# Altium schematic sheet UWB_R_v1.4.SchDoc
size A2; SheetNumber: 1; SheetTotal: 1; SPICEModelCachePXCNLXFV: <root> / <DocumentId>PXCNLXFV</DocumentId> / </root>
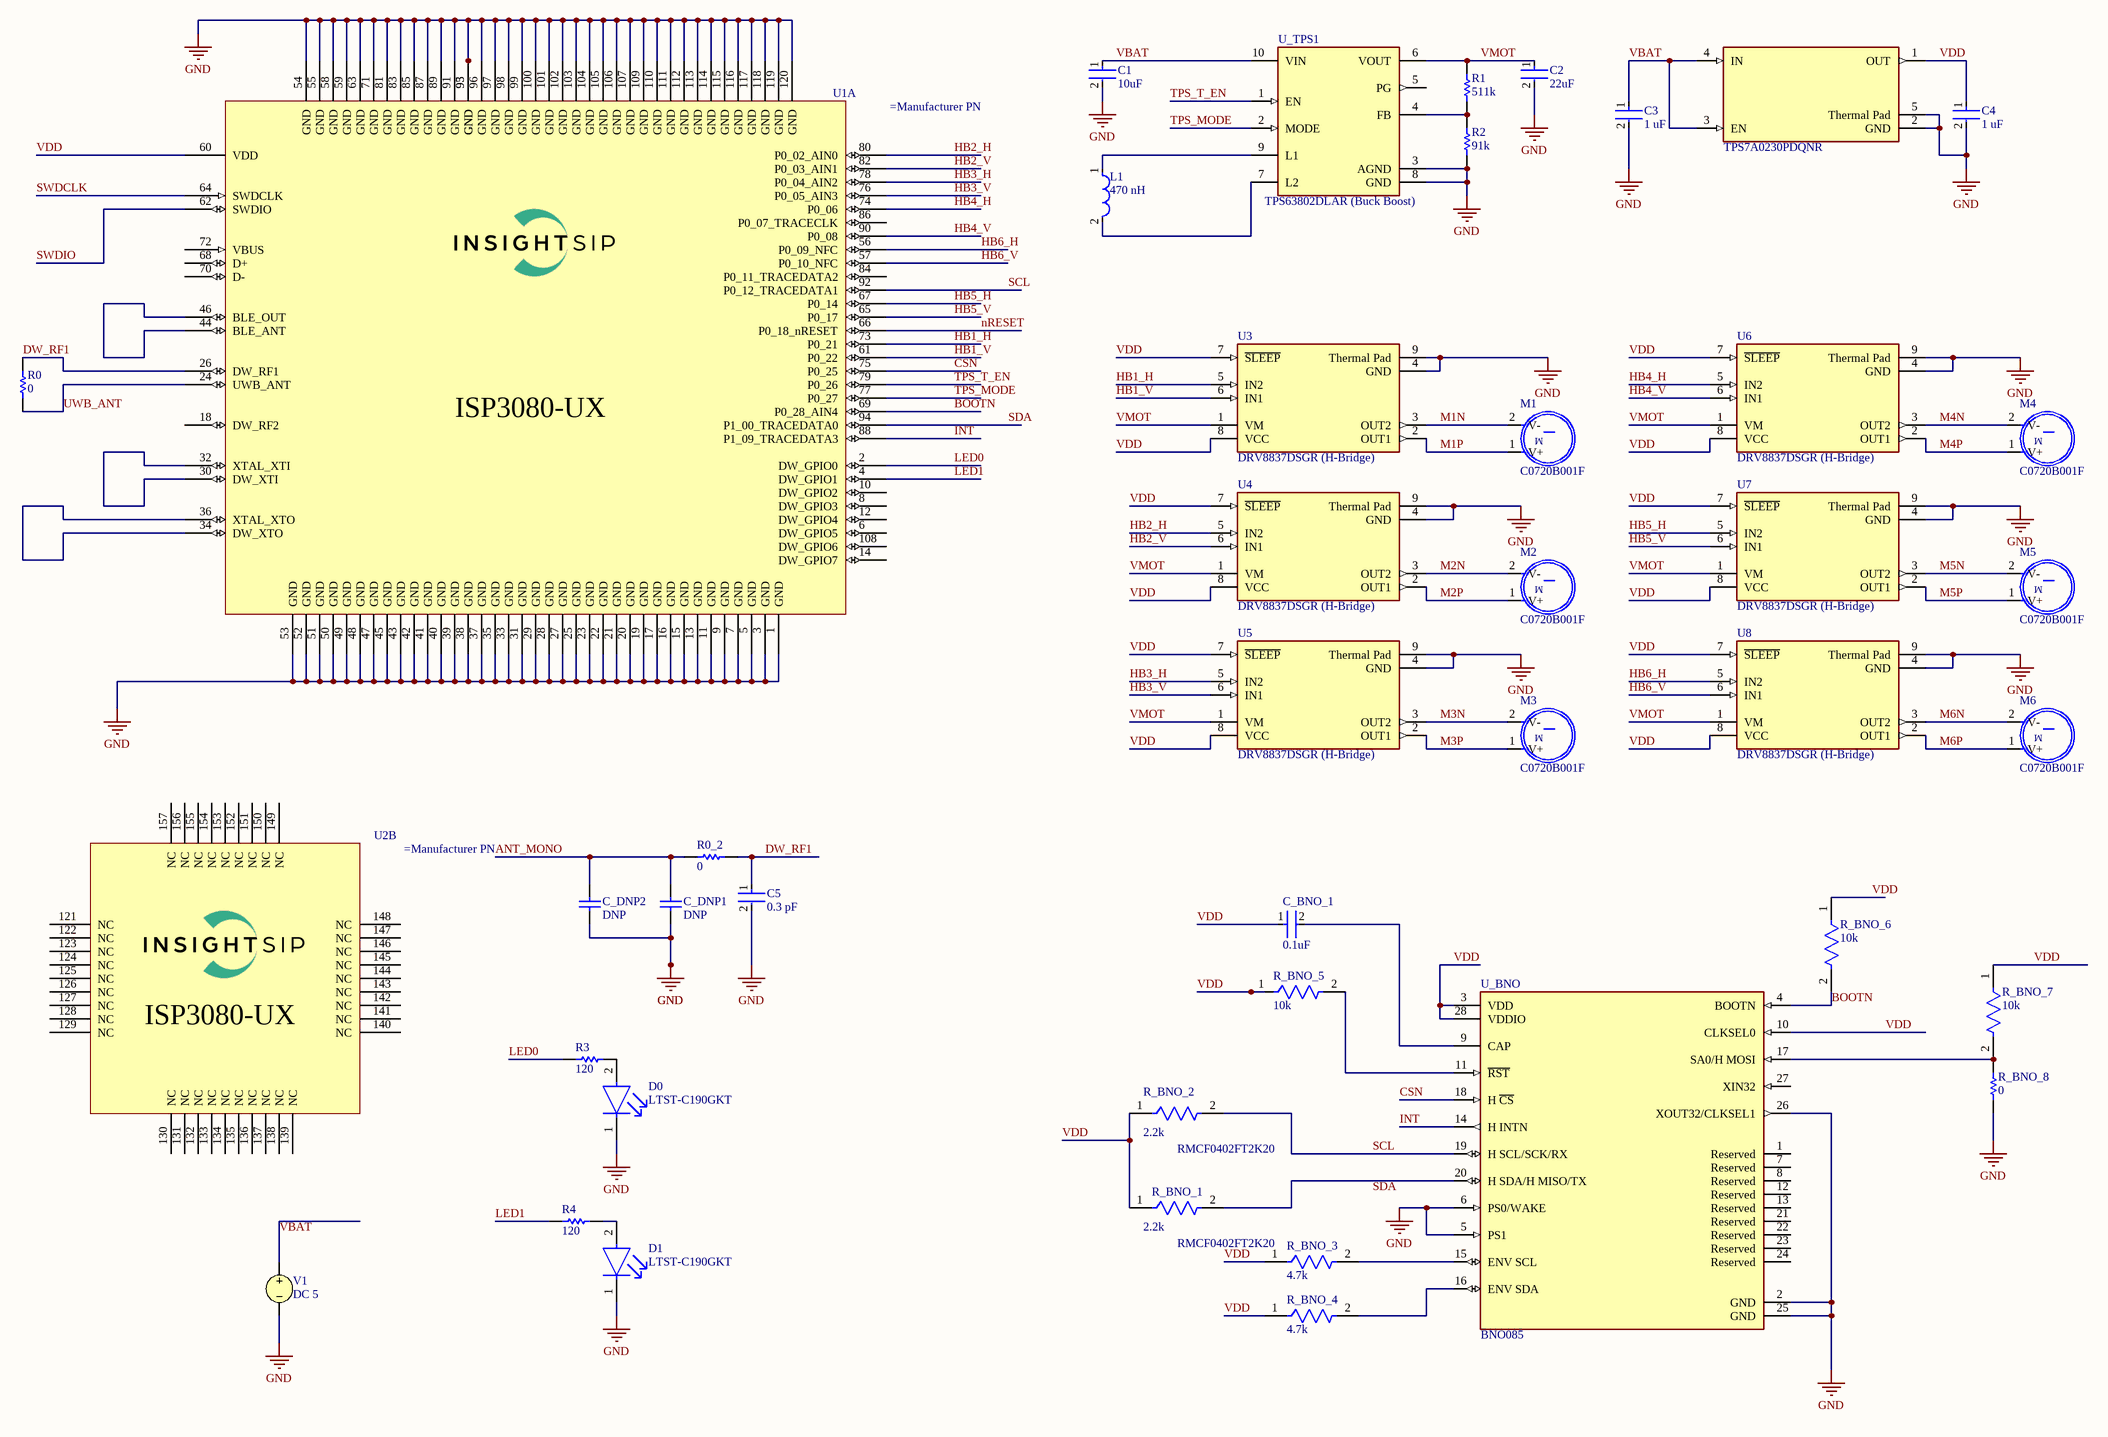
[diagram p0: UWB_R_v1.4.SchDoc]

## Parts
C1  10uF  [FP-CL05A106MP5NUNC-MFG]
C2  22uF  [FP-GRM188-0_2-IPC_C]
C3  1 uF  [FP-CL10-IPC_C]
C4  1 uF  [FP-CL10-IPC_C]
C5  0.3 pF  [FP-GRM033-0_03-IPC_B]
C_BNO_1  0.1uF  [FP-0402B104K160CT-IPC_C]
C_DNP1  DNP  [CAPC1005X56X25NL10T15]
C_DNP2  DNP  [CAPC1005X56X25NL10T15]
D0  LTST-C190GKT  [FP-LTST-C190GKT-MFG]
D1  LTST-C190GKT  [FP-LTST-C190GKT-MFG]
L1  470 nH  [FP-CIGT201610-MFG]
M1  C0720B001F  [XDCR_C0720B001F]
M2  C0720B001F  [XDCR_C0720B001F]
M3  C0720B001F  [XDCR_C0720B001F]
M4  C0720B001F  [XDCR_C0720B001F]
M5  C0720B001F  [XDCR_C0720B001F]
M6  C0720B001F  [XDCR_C0720B001F]
R0  0  [RESC1005X40X25NL05T10]
R0_2  0  [RESC1005X40X25NL05T10]
R1  511k  [RESC1608X55X25ML10T15]
R2  91k  [RESC0603X26X15NL03T05]
R3  120  [RESC2013X50X40ML20T20]
R4  120  [RESC2013X50X40ML20T20]
R_BNO_1  2.2k  [Stackpole_RMCF0402_IPC_A]
R_BNO_2  2.2k  [Stackpole_RMCF0402_IPC_A]
R_BNO_3  4.7k  [FP-RC0402-0_4-MFG]
R_BNO_4  4.7k  [FP-RC0402-0_4-MFG]
R_BNO_5  10k  [FP-RC0603-0_55-IPC_C]
R_BNO_6  10k  [FP-RC0603-0_55-IPC_C]
R_BNO_7  10k  [FP-RC0603-0_55-IPC_C]
R_BNO_8  0  [RESC1005X40X25NL05T10]
TPS7A0230PDQNR  TPS7A0230PDQNR  [Texas_Instruments_DQN0004A_MFG]  (value not drawn)
U1  (no value)  [ISP3080-UX]  (part A of 2)
U2  (no value)  (part B of 2)
U3  DRV8837DSGR (H-Bridge)  [FP-DSG0008A-MFG]
U4  DRV8837DSGR (H-Bridge)  [FP-DSG0008A-MFG]
U5  DRV8837DSGR (H-Bridge)  [FP-DSG0008A-MFG]
U6  DRV8837DSGR (H-Bridge)  [FP-DSG0008A-MFG]
U7  DRV8837DSGR (H-Bridge)  [FP-DSG0008A-MFG]
U8  DRV8837DSGR (H-Bridge)  [FP-DSG0008A-MFG]
U_BNO  BNO085  [FP-BNO085-MFG]
U_TPS1  TPS63802DLAR (Buck Boost)  [FP-DLA0010A-MFG]
V1  DC 5

## Nets
GND: C1.2 C2.2 C3.2 C4.2 C5.2 C_DNP1.1 C_DNP2.1 D0.1(C) D1.1(C) R2.1 R_BNO_8.2 TPS7A0230PDQNR.2(GND) TPS7A0230PDQNR.5(Thermal_Pad) U1.1(GND) U1.3(GND) U1.5(GND) U1.7(GND) U1.9(GND) U1.11(GND) U1.13(GND) U1.15(GND) U1.16(GND) U1.17(GND) U1.19(GND) U1.20(GND) U1.21(GND) U1.22(GND) U1.23(GND) U1.25(GND) U1.27(GND) U1.28(GND) U1.29(GND) U1.31(GND) U1.33(GND) U1.35(GND) U1.37(GND) U1.38(GND) U1.39(GND) U1.40(GND) U1.41(GND) U1.42(GND) U1.43(GND) U1.45(GND) U1.47(GND) U1.48(GND) U1.49(GND) U1.50(GND) U1.51(GND) U1.52(GND) U1.53(GND) U1.54(GND) U1.55(GND) U1.58(GND) U1.59(GND) U1.63(GND) U1.71(GND) U1.81(GND) U1.83(GND) U1.85(GND) U1.87(GND) U1.89(GND) U1.91(GND) U1.93(GND) U1.95(GND) U1.96(GND) U1.97(GND) U1.98(GND) U1.99(GND) U1.100(GND) U1.101(GND) U1.102(GND) U1.103(GND) U1.104(GND) U1.105(GND) U1.106(GND) U1.107(GND) U1.109(GND) U1.110(GND) U1.111(GND) U1.112(GND) U1.113(GND) U1.114(GND) U1.115(GND) U1.116(GND) U1.117(GND) U1.118(GND) U1.119(GND) U1.120(GND) U3.4(GND) U3.9(Thermal_Pad) U4.4(GND) U4.9(Thermal_Pad) U5.4(GND) U5.9(Thermal_Pad) U6.4(GND) U6.9(Thermal_Pad) U7.4(GND) U7.9(Thermal_Pad) U8.4(GND) U8.9(Thermal_Pad) U_BNO.2(GND) U_BNO.5(PS1) U_BNO.6(PS0/WAKE) U_BNO.25(GND) U_BNO.26(XOUT32/CLKSEL1) U_TPS1.3(AGND) U_TPS1.8(GND) V1.2
ANT_MONO: C_DNP1.2 C_DNP2.2 R0_2.2
BOOTN: R_BNO_6.2 U1.69(P0_28_AIN4) U_BNO.4(BOOTN)
CSN: U1.75(P0_25) U_BNO.18(H_~{CS})
DW_RF1: C5.1 R0.2 R0_2.1 U1.26(DW_RF1)
HB1_H: U1.73(P0_21) U3.5(IN2)
HB1_V: U1.61(P0_22) U3.6(IN1)
HB2_H: U1.80(P0_02_AIN0) U4.5(IN2)
HB2_V: U1.82(P0_03_AIN1) U4.6(IN1)
HB3_H: U1.78(P0_04_AIN2) U5.5(IN2)
HB3_V: U1.76(P0_05_AIN3) U5.6(IN1)
HB4_H: U1.74(P0_06) U6.5(IN2)
HB4_V: U1.90(P0_08) U6.6(IN1)
HB5_H: U1.67(P0_14) U7.5(IN2)
HB5_V: U1.65(P0_17) U7.6(IN1)
HB6_H: U1.56(P0_09_NFC) U8.5(IN2)
HB6_V: U1.57(P0_10_NFC) U8.6(IN1)
INT: U1.88(P1_09_TRACEDATA3) U_BNO.14(H_INTN)
LED0: R3.1 U1.2(DW_GPIO0)
LED1: R4.1 U1.4(DW_GPIO1)
M1N: M1.2(V-) U3.3(OUT2)
M1P: M1.1(V+) U3.2(OUT1)
M2N: M2.2(V-) U4.3(OUT2)
M2P: M2.1(V+) U4.2(OUT1)
M3N: M3.2(V-) U5.3(OUT2)
M3P: M3.1(V+) U5.2(OUT1)
M4N: M4.2(V-) U6.3(OUT2)
M4P: M4.1(V+) U6.2(OUT1)
M5N: M5.2(V-) U7.3(OUT2)
M5P: M5.1(V+) U7.2(OUT1)
M6N: M6.2(V-) U8.3(OUT2)
M6P: M6.1(V+) U8.2(OUT1)
nRESET: U1.66(P0_18_nRESET)
SCL: R_BNO_2.2 U1.92(P0_12_TRACEDATA1) U_BNO.19(H_SCL/SCK/RX)
SDA: U1.94(P1_00_TRACEDATA0)
SWDCLK: U1.64(SWDCLK)
SWDIO: U1.62(SWDIO)
TPS_MODE: U1.77(P0_27) U_TPS1.2(MODE)
TPS_T_EN: U1.79(P0_26) U_TPS1.1(EN)
UWB_ANT: R0.1 U1.24(UWB_ANT)
VBAT: C1.1 C3.1 TPS7A0230PDQNR.3(EN) TPS7A0230PDQNR.4(IN) U_TPS1.10(VIN) V1.1
VDD: C4.1 C_BNO_1.1 R_BNO_1.1 R_BNO_2.1 R_BNO_3.1 R_BNO_4.1 R_BNO_5.1 R_BNO_6.1 R_BNO_7.1 TPS7A0230PDQNR.1(OUT) U1.60(VDD) U3.7(~{SLEEP}) U3.8(VCC) U4.7(~{SLEEP}) U4.8(VCC) U5.7(~{SLEEP}) U5.8(VCC) U6.7(~{SLEEP}) U6.8(VCC) U7.7(~{SLEEP}) U7.8(VCC) U8.7(~{SLEEP}) U8.8(VCC) U_BNO.3(VDD) U_BNO.10(CLKSEL0) U_BNO.28(VDDIO)
VMOT: C2.1 R1.2 U3.1(VM) U4.1(VM) U5.1(VM) U6.1(VM) U7.1(VM) U8.1(VM) U_TPS1.6(VOUT)
NetC_BNO_1_2: C_BNO_1.2 U_BNO.9(CAP)
NetD0_2: D0.2(A) R3.2
NetD1_2: D1.2(A) R4.2
NetL1_1: L1.1 U_TPS1.9(L1)
NetL1_2: L1.2 U_TPS1.7(L2)
NetR1_1: R1.1 R2.2 U_TPS1.4(FB)
NetR_BNO_1_2: R_BNO_1.2 U_BNO.20(H_SDA/H_MISO/TX)
NetR_BNO_3_2: R_BNO_3.2 U_BNO.15(ENV_SCL)
NetR_BNO_4_2: R_BNO_4.2 U_BNO.16(ENV_SDA)
NetR_BNO_5_2: R_BNO_5.2 U_BNO.11(~{RST})
NetR_BNO_7_2: R_BNO_7.2 R_BNO_8.1 U_BNO.17(SA0/H_MOSI)
NetU1_30: U1.30(DW_XTI) U1.32(XTAL_XTI)
NetU1_34: U1.34(DW_XTO) U1.36(XTAL_XTO)
NetU1_44: U1.44(BLE_ANT) U1.46(BLE_OUT)

Not connected (* = marked no-connect by the designer): U1 6(DW_GPIO5) 8(DW_GPIO3) 10(DW_GPIO2) 12(DW_GPIO4) 14(DW_GPIO7) 18(DW_RF2) 68(D+) 70(D-) 72(VBUS) 84(P0_11_TRACEDATA2) 86(P0_07_TRACECLK) 108(DW_GPIO6); U2 121(NC) 122(NC) 123(NC) 124(NC) 125(NC) 126(NC) 127(NC) 128(NC) 129(NC) 130(NC) 131(NC) 132(NC) 133(NC) 134(NC) 135(NC) 136(NC) 137(NC) 138(NC) 139(NC) 140(NC) 141(NC) 142(NC) 143(NC) 144(NC) 145(NC) 146(NC) 147(NC) 148(NC) 149(NC) 150(NC) 151(NC) 152(NC) 153(NC) 154(NC) 155(NC) 156(NC) 157(NC); U_BNO 1(Reserved) 7(Reserved) 8(Reserved) 12(Reserved) 13(Reserved) 21(Reserved) 22(Reserved) 23(Reserved) 24(Reserved) 27(XIN32); U_TPS1 5(PG)

## Notes on the sheet
- Labels drawn without touching a wire or pin: SDA
- (in symbol C0720B001F) M

## Library data of the parts
C1 = CMP-13271-000002-1: CL05A106MP5NUNC CAP CER 10UF 10V X5R 0402; Manufacturer: Samsung; Temperature Coefficient: 15%; Tolerance: 20%; Material: Ceramic; Octopart: https://octopart.com/cl05a106mp5nunc-samsung-22457395; Voltage Rating: 10V; RoHS: TRUE; Value: 10uF; Height: 0.7mm; Digikey Description: CAP CER 10UF 10V X5R 0402; Automotive: No; Package: CL05A106MP5NUNC; Device Class L1: Passive Components; Capacitance: 10uF; Temperature Range High: +85°C; ComponentLink2Description: Datasheet; Device Class L2: Capacitors; Temperature Characteristic: X5R; Manufacturer Part Number: CL05A106MP5NUNC; Temperature: -55°C to +85°C; ComponentLink2URL: http://www.samsungsem.com/kr/support/product-search/mlcc/__icsFiles/afieldfile/2019/05/10/19-CL05A106MP5NUNC.pdf; Device Class L3: Ceramic Capacitors; Category: Cap; Temperature Range Low: -55°C; Ipc Land Pattern Name: CAPC10050X50; Lead Free: Yes
C2 = CMP-2000-06337-3: GRM188R61A226ME15D Chip Multilayer Ceramic Capacitors for General Purpose, 0603, 22uF, X5R, 15%, 20%, 10V; Tolerance: 20%; Weight: 0.000222oz; Material: Ceramic; Depth: 0.8mm; Length: 1.6mm; Termination: SMD/SMT; Capacitance: 22uF; Packaging: Tape and Reel; Width: 0.8mm; Voltage Rating: 10V; Case Code (Imperial): 0603; Mount: Surface Mount; Voltage Rating (DC): 10V; Case/Package: 0603; Thickness: 0.039inch; REACH SVHC: No SVHC; Dielectric: X5R; Height: 0.8mm; Package Quantity: 4000; Case Code (Metric): 1608; Min Operating Temperature: -55°C; Lead Free: Lead Free; Max Operating Temperature: 85°C
C3 C4 = CMP-2000-06094-2: CL10B105KP8NNNC Cap Ceramic 1uF 10V X7R ±10% Pad SMD 0603 +125°C T/R; Packaging: Tape and Reel; Depth: 0.8mm; Voltage Rating: 10V; Lead Free: Lead Free; Radiation Hardening: No; Capacitance: 1uF; Length: 1.6mm; Package Quantity: 1; Mount: Surface Mount; Case/Package: 0603; Max Operating Temperature: 125°C; Case Code (Metric): 1608; Height: 0.8mm; Min Operating Temperature: -55°C; Dielectric: X7R; Contact Plating: Tin; Case Code (Imperial): 0603; Thickness: 0.035inch; Voltage Rating (DC): 10V; Tolerance: 10%; Width: 0.031inch
C5 = CMP-2010-01482-2: GRM0335C1ER30BA01D; Dielectric: C0G; Voltage Rating (DC): 25V; Capacitance: 0.3pF; Case Code (Metric): 0603; Case Code (Imperial): 0201; Thickness: 0.013inch; Max Operating Temperature: 125°C; Width: 0.3mm; Min Operating Temperature: -55°C; Height: 0.3mm; Package Quantity: 15000; Termination: SMD/SMT; Length: 0.024inch; Packaging: Tape and Reel; Voltage Rating: 25V; Mount: Surface Mount; Case/Package: 0201
C_BNO_1 = CMP-45632-000002-1: CAP CER 0.1UF 16V X7R 0402 0402B104K160CT; Capacitance: 100nF; Tolerance: 10%; Case Code (Imperial): 0402; Length: 1mm; Radiation Hardening: No; Case Code (Metric): 1005; Max Operating Temperature: 125°C; Voltage Rating: 16V; Voltage Rating (DC): 16V; Dielectric: X7R; RoHS Compliant: Yes; Packaging: Tape and Reel; Lead Free: Lead Free; Depth: 0.5mm; Case/Package: 0402; Min Operating Temperature: -55°C; Series: -
C_DNP1 C_DNP2 = CMP-1034-00866-2: Part Number: 04025A180KAT2A; Manufacturer: AVX Interconnect / Elco
D0 D1 = CMP-22017-000005-2: LED GREEN CLEAR CHIP SMD; Dominant Wavelength: 569nm; Reverse Voltage: 5V; Lens Color: Colorless; Viewing Angle: 130°; Voltage: 2V; Forward Current: 30mA; Power Dissipation: 100mW; Luminous Intensity: 6mcd; Number of LEDs: 1; Forward Voltage: 2.1V; Wavelength: 565nm; Test Current: 10mA; Min Operating Temperature: -55°C; Lens Style: Clear; Mount: Surface Mount; Width: 0.8mm; Packaging: Tape and Reel; Lens Transparency: Clear; Case Code (Metric): 1608; Depth: 0.8mm; Case Code (Imperial): 0603; Case/Package: 0603; Number of Pins: 2; Max Operating Temperature: 85°C; Lead Free: Lead Free; Number of Elements: 1; Length: 1.6mm; Height: 0.8mm; Package Quantity: 1; Power Rating: 100mW; Radiation Hardening: No; Illumination Color: Green; Color: Green
L1 = CMP-13278-000008-1: CIGT201610EHR47MNE FIXED IND 470NH 4.8A 22MOHM SMD; Shielding: Unshielded; Saturation Current: 5.9A; Core Material: Metal; DC Resistance (DCR): 22mR; Tolerance: 20%; Test Frequency: 1MHz; Current Rating: 4.8A; Max Operating Temperature: 125°C; Series: CIGT; Min Operating Temperature: -40°C; Case/Package: 0806; RoHS Compliant: Yes; Case Code (Imperial): 0806; Packaging: Cut Tape; Mount: Surface Mount; Resistor Type: Thin Film; Inductance: 470nH; Case Code (Metric): 2016
M1-M6 = C0720B001F: DC Motor Vibration, ERM 10000 RPM 3VDC; MF: Jinlong Machinery; Availability: Unavailable; SnapEDA_Link: https://www.snapeda.com/parts/C0720B001F/Jinlong%20Machinery%20%26%20Electronics%2C%20Inc./view-part/645169/?ref=snap; MP: C0720B001F; Value: *; Price: None; Package: Jinlong Machinery
R0 R0_2 R_BNO_8 = CMP-1011-00001-2: RC0402JR-070RL; Manufacturer: Yageo / Phycomp; Part Number: RC0402JR-070RL
R1 = CMP-2000-04074-1: RC0603FR-07511KL; Manufacturer: Yageo; Part Number: RC0603FR-07511KL
R2 = CMP-2004-03561-1: ERJ1GNF9102C; Manufacturer: Panasonic; Part Number: ERJ1GNF9102C
R3 R4 = CMP-2001-04810-1: RG2012N-121-W-T1; Manufacturer: Susumu; Part Number: RG2012N-121-W-T1
R_BNO_1 R_BNO_2 = RMCF0402FT2K20: RES SMD 2.2K OHM 1% 1/16W 0402 RMCF0402FT2K20; Manufacturer: Stackpole; Capacitance: SKIP; Library Path1: parts/Res_Stackpole_RMCF0402FT2K20_eec.SchLib; Power Rating: 0.063W; Resistance: 2.2kΩ; Standoff Height: 0mm; Temperature Coefficient: 100ppm/ºC; Value: 2.2kΩ; Verification Version: 0.0.0.1; Voltage Rating: 50V; Part Number: RMCF0402FT2K20; Datasheet Path: datasheets/Res_Stackpole_RMCF0402FT2K20_eec.pdf; ComponentLink1Description: Upverter; ComponentLink1URL: https://upverter.com/upn/revision/0aaa626533066db0/; ComponentLink2Description: Datasheet; ComponentLink2URL: https://www.seielect.com/Catalog/SEI-RMCF_RMCP.pdf; Composition: Thick Film; Datasheet Path1: datasheets/Res_Stackpole_RMCF0402FT2K20_eec.pdf; Digikey Description: RES SMD 2.2K OHM 1% 1/16W 0402; Digikey Part Number: RMCF0402FT2K20TR-ND; Height: 0.4mm; Inductance: SKIP; Ipc Land Pattern Name: RESC10050X414; Lead Free: yes; Library Ref1: RMCF0402FT2K20; Package: RMCF0402; Price: 0.0085405425652; RoHS: TRUE; Series: CRCW; Supplier 1: Digi-Key; Supplier 2: Mouser; Supplier Part Number 1: RMCF0402FT2K20TR-ND; Temperature: -55°C to +155°C; Temperature Range High: +155°C; Temperature Range Low: -55°C; Tolerance: 1%; Voltage: SKIP; helpURL: https://upverter.com/upn/revision/0aaa626533066db0/
R_BNO_3 R_BNO_4 = CMP-2002-08011-2: RC0402JR-074K7L; Tolerance: 5%; Power Rating: 63mW; Resistance: 4.7kΩ; Voltage Rating: 50V; Temperature Coefficient: 100ppm/°C; Composition: Thick Film; Max Operating Temperature: 155°C; Case/Package: 0402; Depth: 500µm; Packaging: Tape & Reel; Number of Pins: 2; Schedule B: 8533210045, 8533210045; Case Code (Imperial): 0402; Termination: SMD/SMT; Military Standard: Not; Lead Free: Lead Free; Width: 500µm; REACH SVHC: No SVHC; Max Power Dissipation: 63mW; Voltage Rating (AC): 50V; Features: Moisture Resistant; Min Operating Temperature: -55°C; Number of Terminations: 2; RoHS: Compliant; Height: 350µm; Voltage Rating (DC): 50V; Length: 1mm
R_BNO_5-R_BNO_7 = CMP-2100-03664-2: RES 10K OHM 1% 1/10W 0603 / RC0603FR-0710KL; Voltage Rating: 75V; Voltage Rating (DC): 50V; Resistance: 10kR; Power Rating: 100mW; Temperature Coefficient: 100ppm/°C; Depth: 0.8mm; Termination: SMD/SMT; Resistor Type: Thick Film; Series: RC; Construction: Rectangular; Features: Moisture Resistant; Packaging: Tape and Reel; Min Operating Temperature: -55°C; Number of Terminations: 2; Lead Pitch: 0.3mm; RoHS Compliant: Yes; Case/Package: 0603; Resistance Tolerance: 1%; Military Standard: Not; Weight: 7.1E-05oz; Number of Pins: 2; Tolerance: 1%; Length: 1.6mm; Case Code (Imperial): 0603; Lead Free: Lead Free; Width: 0.8mm; Max Power Dissipation: 100mW; Height: 0.45mm; Max Operating Temperature: 155°C; Case Code (Metric): 1608; Size Code: 0603
TPS7A0230PDQNR = TPS7A0230PDQNR: Linear Voltage Regulator IC, 1 Output, 6-1.5 V to 0.8-5 V (Fixed) Output, 200mA, 4-X2SON (1x1); Manufacturer: Texas Instruments; Accuracy Percentage: 1.5%; Dropout Voltage: 310mV; Max Junction Temp: +125°C; Max Supply Voltage: 6V; Min Supply Voltage: 1.5V; Nominal Supply Current: 0.025uA; Number Of Outputs: 1; Output Voltage: 3V; Standoff Height: 0mm; Symbol Hash: 259b0d140b6f650e9c7638141f7cf96fb484ba133eb2d14c3f1df3439be7db40; Verification Version: 0.0.0.3; Datasheet Path: datasheets/IC_Texas_Instruments_TPS7A0230PDQNR_eec.pdf; Automotive: No; ComponentLink1Description: Upverter; ComponentLink1URL: https://upverter.com/part/id/efb1ed112b5b9d75/; ComponentLink2Description: Datasheet; ComponentLink2URL: https://www.ti.com/lit/ds/symlink/tps7a02.pdf; Digikey Description: NANOPOWER LDO; Digikey Part Number: 296-TPS7A0230PDQNRCT-ND; Height: 0.4mm; Lead Free: Yes; Mouser Part Number: 595-TPS7A0230PDQNR; Output Current: 200mA; Output Type: Fixed; Package: DQN0004A; Part Number: TPS7A0230PDQNR; RoHS: TRUE; Supplier 1: Digi-Key; Supplier 2: Mouser; Supplier Part Number 1: 296-TPS7A0230PDQNRCT-ND; Supplier Part Number 2: 595-TPS7A0230PDQNR; Temperature: -40°C to +125°C; Temperature Range High: +125°C; Temperature Range Low: -40°C; helpURL: https://upverter.com/part/id/efb1ed112b5b9d75/
U1 U2 = ISP3080-UX: BLE & UWB module (Revision C)
U3-U8 = CMP-04915-000004-1: IC MOTOR DRIVER PAR 8WSON; Manufacturer: Texas Instruments; Switching Frequency: 0-250kHz; Min Supply Voltage: 1.8V; Standoff Height: 0mm; Max Supply Voltage: 7V; Output Voltage: 0-11V; Motor Type: Brushed; Number Of Outputs: 2; Output Current: 1.8A; Max Junction Temp: +150°C; Nominal Supply Current: 300-700uA; Mouser Description: Motor / Motion / Ignition Controllers & Drivers 1.8A Low Vltg Brush DC Motor Driver; Device Class L2: Power Management ICs; Manufacturer Part Number: DRV8837DSGR; Temperature Range Low: -40°C; Lead Free: Yes; Height: 0.8mm; Device Class L3: Motor Drivers; Octopart: https://octopart.com/drv8837dsgr-texas+instruments-23786726; Package: DSG0008A; ComponentLink2URL: http://www.ti.com/lit/ds/symlink/drv8837.pdf; Temperature: -40°C to +85°C; Ambient Temperature Range Low: -40°C; ComponentLink2Description: Datasheet; Ambient Temperature Range High: +85°C; Device Class L1: Integrated Circuits (ICs); Category: IC; Temperature Range High: +85°C; RoHS: TRUE; Automotive: No; Digikey Description: IC MOTOR DRIVER PAR 8WSON
U_BNO = CMP-197298-000001-1: IMU ACCEL/GYRO/MAG I2C 32BIT; Manufacturer: Hillcrest Laboratories, Inc.; Sensor Type: Accelerometer,Gyroscope,Magnetometer; Max Supply Voltage: 3.6V; Sensor Output: I2C,SPI,UART; Accel Range: 8g; Min Supply Voltage: 1.7V; Temperature Range High: +85°C; ComponentLink2URL: https://www.hillcrestlabs.com/download/5a747b8d566d073a5d000536; Octopart: https://octopart.com/bno085-hillcrest+laboratories-92813482; Height: 1.18mm; Device Class L1: Sensors; Digikey Description: IMU ACCEL/GYRO/MAG I2C 32BIT; Automotive: No; Package: BNO085; Device Class L3: Inertial Measurement Units (IMUs); Temperature: -40°C to +85°C; Category: IC; Device Class L2: Motion Sensors; Lead Free: Yes; Manufacturer Part Number: BNO085; Temperature Range Low: -40°C; RoHS: TRUE; ComponentLink2Description: Datasheet
U_TPS1 = CMP-04918-000005-1: IC POWER MANAGEMENT; Manufacturer: Texas Instruments; Nominal Supply Current: 11uA; Max Junction Temp: +125°C; Max Supply Voltage: 5.5V; Switching Topology: Buck-Boost; Min Supply Voltage: 1.3V; Output Current: 2A; Output Voltage: 1.8-5.2V; Number Of Outputs: 1; Switching Frequency: 1.4/1.6/2.1MHz; Standoff Height: 0mm; Max Duty Cycle: 100%; Output Type: AdjustableProgrammable; Manufacturer Part Number: TPS63802DLAR; ComponentLink2URL: https://www.ti.com/lit/ds/symlink/tps63802.pdf; Digikey Description: IC POWER MANAGEMENT; Octopart: https://octopart.com/tps63802dlar-texas+instruments-97359678; Height: 1mm; Temperature: -40°C to +125°C; Device Class L3: Voltage Regulators - Switching; Lead Free: Yes; Category: IC; Mouser Description: 2-A, high-efficient, 11-µA quiescent current buck-boost converter in QFN/DFN package 10-VSON-HR -40 to 125; ComponentLink2Description: Datasheet; Temperature Range Low: -40°C; Temperature Range High: +125°C; Automotive: No; Device Class L2: Power Management ICs; RoHS: TRUE; Device Class L1: Integrated Circuits (ICs); Package: DLA0010A
V1 = VSRC: Voltage Source; Note: PCB Footprint - Not required; AC Magnitude: 1; AC Phase: 0; Value: 5; Published: 8-Jun-2000; LatestRevisionDate: 17-Jul-2002; LatestRevisionNote: Re-released for DXP Platform.; PackageReference: Not Applicable; Publisher: Altium Limited